# EAGLE design Layout Rev4 (EAGLE 7.7.0)
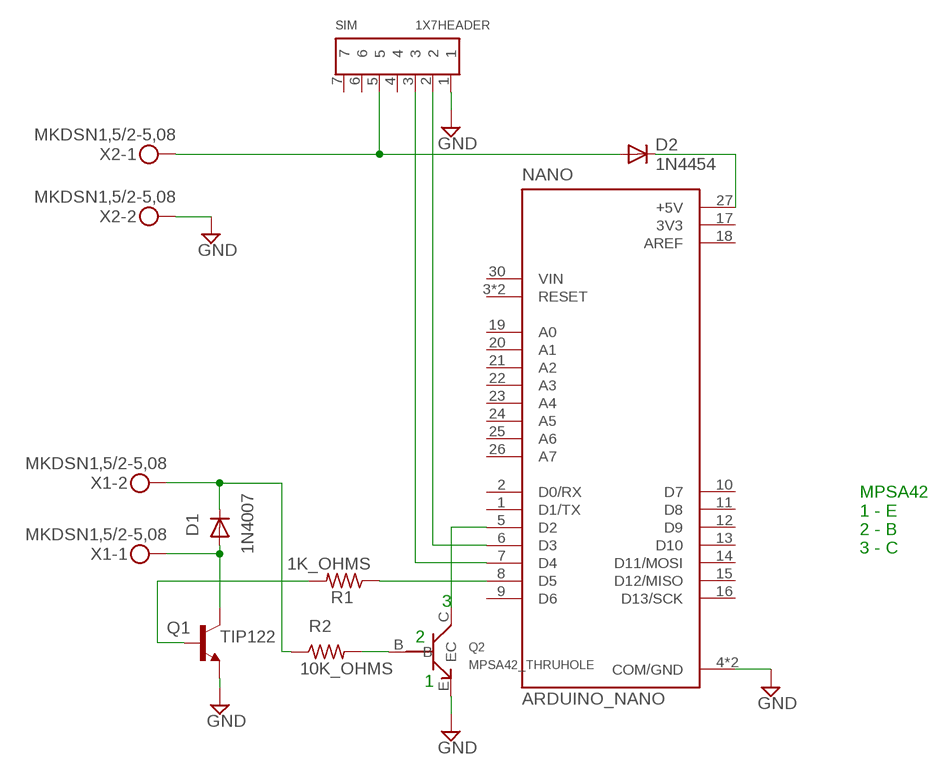
[diagram p0: schematic, sheet 1]

## Parts
D1  1N4007  1N4004  [DO41-10]
D2  1N4454  1N4004  [DO41-10]
NANO  ARDUINO_NANO  [SHIELD_ARDUINO_NANO]
Q1  TIP122  2SC1306  [TO220BV]
Q2  MPSA42_THRUHOLE  [MPSA42]
R1  1K_OHMS  R-US_0207/10  [0207/10]
R2  10K_OHMS  R-US_0207/10  [0207/10]
SIM  1X7HEADER  [1X7HEADER]
X1  MKDSN1,5/2-5,08  [MKDSN1,5/2-5,08]
X2  MKDSN1,5/2-5,08  [MKDSN1,5/2-5,08]

## Nets
+5V [power]: D2.A SIM.5 X2.1
GND: NANO.4(COM/GND) NANO.29(COM/GND) Q1.3(E) Q2.E SIM.1 X2.2
N$1: NANO.7(D4) SIM.3
N$2: NANO.6(D3) SIM.2
N$3 [power]: D1.C R2.1 X1.2
N$4: NANO.8(D5) R1.1
N$5 [power]: D1.A Q1.2(C) X1.1
N$7: Q2.B R2.2
N$10 [power]: D2.C NANO.27(+5V)
N$15: NANO.5(D2) Q2.C
N$16: Q1.1(B) R1.2
Unconnected: NANO.1(D1/TX) NANO.2(D0/RX) NANO.3(RESET) NANO.9(D6) NANO.10(D7) NANO.11(D8) NANO.12(D9) NANO.13(D10) NANO.14(D11/MOSI) NANO.15(D12/MISO) NANO.16(D13/SCK) NANO.19(A0) NANO.20(A1) NANO.21(A2) NANO.22(A3) NANO.23(A4) NANO.24(A5) NANO.25(A6) NANO.26(A7) NANO.28(RESET) NANO.30(VIN) SIM.4 SIM.6 SIM.7

## Notes on the sheet
- MPSA42
  1 - E
  2 - B
  3 - C
- 3
- 2
- 1

## Power pins joined to a net without a drawn wire
3V3: NANO.17(3V3)
AREF: NANO.18(AREF)

## Library data of the parts
D1 D2 = diode:1N4004: DIODE general purpose rectifier, 1 A
NANO = ARDUINO_NANO:ARDUINO_NANO: Arduino Nano, Through Hole; AVAILABILITY: Unavailable; DESCRIPTION: Dev.kit: Arduino; UART; ICSP, USB B mini, pin strips; MF: Arduino; MP: ARDUINO NANO; PACKAGE: None; PRICE: None
Q1 = transistor:2SC1306: NPN Transistor Final RF Power Outupt Source: 2sc1306.pdf
Q2 = MPSA42_thruhole:MPSA42_THRUHOLE
R1 R2 = rcl:R-US_: RESISTOR, American symbol; SPICEPREFIX: R
SIM = 1x7header:1X7HEADER
X1 X2 = con-phoenix-508:MKDSN1,5/2-5,08: MKDSN 1,5/ 2-5,08 Printklemme Nennstrom: 13,5 A Nennspannung: 250 V Rastermaß: 5,08 mm Polzahl: 2 Anschlussart: Schraubanschluss Montage: Löten Anschlussrichtung Leiter/Platine: 0 ° Artikelnummer: 1729128 Source: http://eshop.phoenixcontact.com .. 1729128.pdf

## Net classes
0 default: width 0.254 mm, drill 0.305 mm, clearance 0.305 mm
1 power: width 0.61 mm, drill 0.66 mm, clearance 0.305 mm
2 power1: width 3.81 mm, drill 2.54 mm, clearance 0.305 mm

## Board
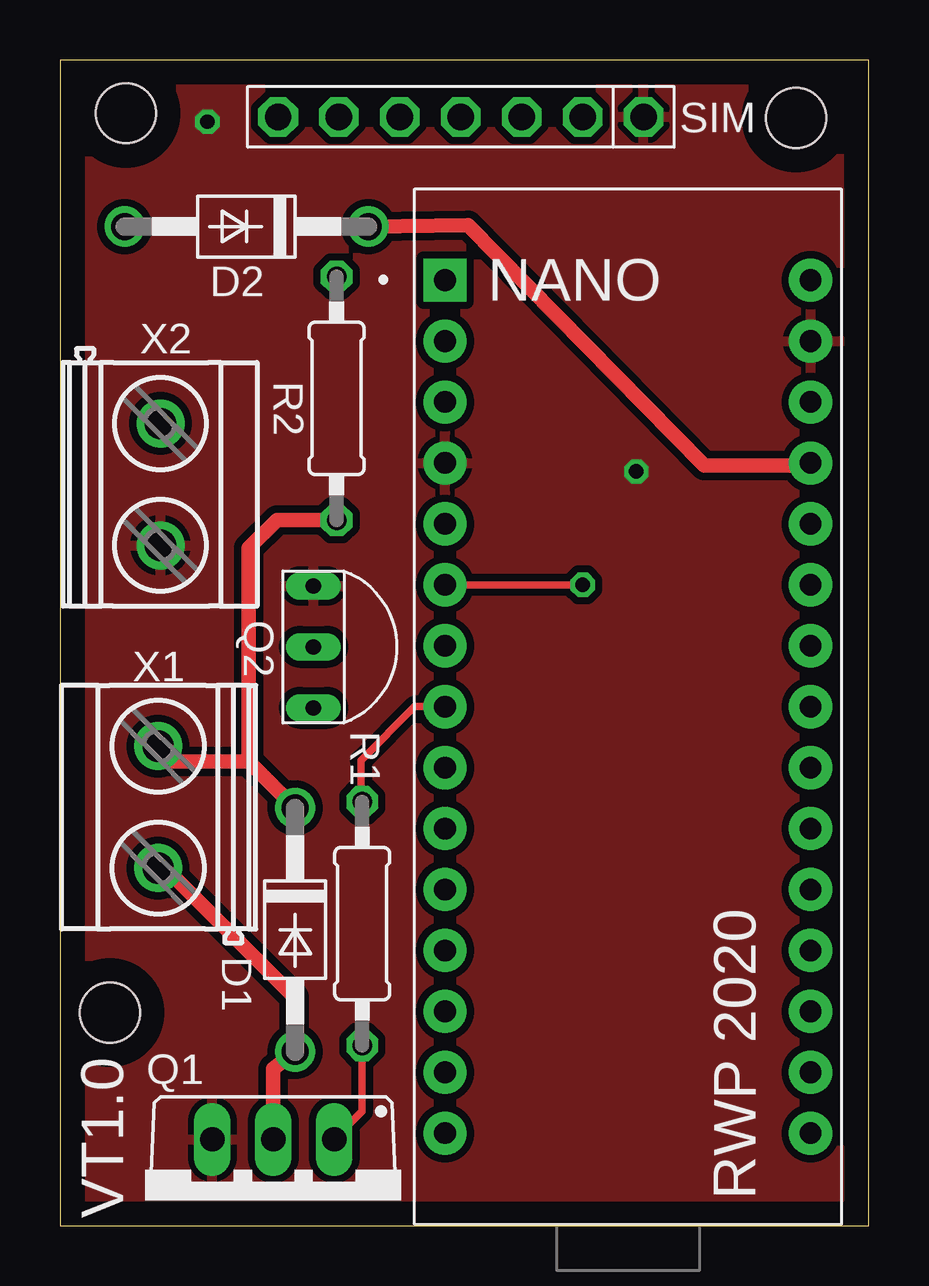
[diagram p1: board, top side]
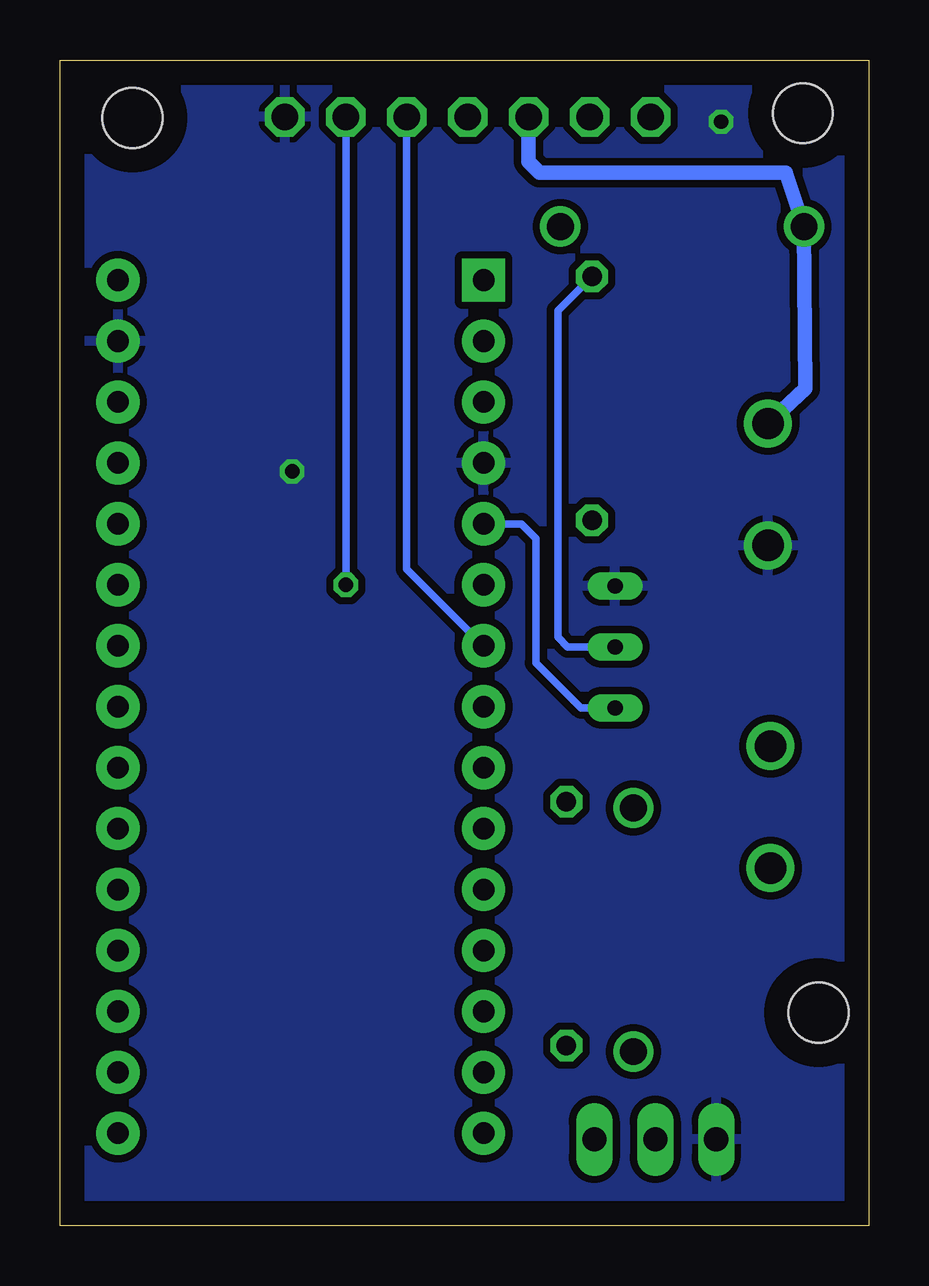
[diagram p2: board, bottom side, seen from below]

Size 33.71 x 48.6 mm. Coordinates in mm from the lower left corner, seen from the top.
Outline: 0,0 33.71,0 33.71,48.6 0,48.6 0,0
Copper layers (1*16): Top 0.035mm / dielectric 1.5mm / Bottom 0.035mm
Design rules "default *": minimum track width 10mil, minimum drill 24mil, track to track 6mil, track to pad 6mil, pad to pad 6mil, via to via 6mil, smd to smd 8mil, copper to edge 40mil, drill to drill 6mil, minimum pad ring 10mil, minimum via ring 8mil, stop-mask expansion 4mil, vias tented up to drill 0mil, thermal gap 10mil
Holes 2.5 mm at 2.08,8.89 2.74,46.38 30.68,46.18

### Footprints (pad centres in the part's own frame; a part is rotated, then mirrored left to right if it is on the bottom)
DO41-10 = drill 1.118: A 5.08,0; C -5.08,0
SHIELD_ARDUINO_NANO = drill 0.9 pad 1.8 square: 1 -7.62,17.78 | drill 0.9 pad 1.8: 2 -7.62,15.24; 3 -7.62,12.7; 4 -7.62,10.16; 5 -7.62,7.62; 6 -7.62,5.08; 7 -7.62,2.54; 8 -7.62,0; 9 -7.62,-2.54; 10 -7.62,-5.08; 11 -7.62,-7.62; 12 -7.62,-10.16; 13 -7.62,-12.7; 14 -7.62,-15.24; 15 -7.62,-17.78; 16 7.62,-17.78; 17 7.62,-15.24; 18 7.62,-12.7; 19 7.62,-10.16; 20 7.62,-7.62; 21 7.62,-5.08; 22 7.62,-2.54; 23 7.62,0; 24 7.62,2.54; 25 7.62,5.08; 26 7.62,7.62; 27 7.62,10.16; 28 7.62,12.7; 29 7.62,15.24; 30 7.62,17.78
TO220BV = drill 1.016 long: 1 -2.54,-2.54; 2 0,-2.54; 3 2.54,-2.54
MPSA42 = drill 0.635 pad 0.889 long: B 0,0; C 2.54,0; E -2.54,0
0207/10 = drill 0.813 octagon: 1 -5.08,0; 2 5.08,0
1X7HEADER = drill 1.1 octagon: 1 0,0; 2 2.54,0; 3 5.08,0; 4 7.62,0; 5 10.16,0; 6 12.7,0; 7 15.24,0
MKDSN1,5/2-5,08 = drill 1.3 pad 2: 1 -2.561,0.025; 2 2.519,0.025

### Placement (x,y rotation side)
D1  9.8,12.34 270 top
D2  7.77,41.66 180 top
NANO  23.67,21.64 0 top
Q1  8.89,1.07 180 top
Q2  10.57,24.13 270 top
R1  12.6,12.6 270 top
R2  11.53,34.49 90 top
SIM  24.33,46.23 180 top
X1  4.11,17.48 90 top
X2  4.17,30.89 270 top

### Tracks (layer width: path | path; a pad name or v marks a point on that pad's centre or on a via)
+5V
  Bottom 0.61: X2.1 2.64,34.9 D2.A 3.45,43.89 13.72,43.89 14.17,44.35 SIM.5
GND  (via drill 0.6)
  other vias: 24.03,31.45 6.15,46.02
  pour Top: -2.95,49.99 35.92,50.04 35.86,-4.37 -3.35,-3.45 -3.3,49.99
  pour Bottom: -2.69,49.48 35.15,49.48 35.1,-3.51 -3.05,-3.51
N$1
  Bottom 0.305: SIM.3 19.25,27.38 NANO.7
N$2  (via drill 0.6)
  Top 0.305: v21.79,26.72 NANO.6
  Bottom 0.305: SIM.2 v21.79,26.72
N$3
  Top 0.61: R2.1 9.04,29.41 7.87,28.25 7.87,19.36 | 7.87,19.36 D1.C | 7.87,19.36 4.73,19.36 X1.2
N$4
  Top 0.305: NANO.8 14.78,21.64 12.55,19.41 12.55,17.73 R1.1
N$5
  Top 0.61: Q1.2 8.89,6.55 D1.A 9.75,7.32 9.75,9.55 4.39,14.91 X1.1
N$7
  Bottom 0.305: R2.2 12.95,38.15 12.95,24.54 12.55,24.13 Q2.B
N$10
  Top 0.61: NANO.27 31.27,31.7 26.86,31.7 17,41.71 D2.C
N$15
  Bottom 0.305: NANO.5 14.48,29.26 13.87,28.65 13.87,23.47 11.99,21.59 Q2.C
N$16
  Top 0.305: R1.2 12.6,4.78 Q1.1

### Text on the board
tPlace: RWP 2020 | VT1.0